# Altium schematic sheet [16]-CLOCK.SchDoc
size A4
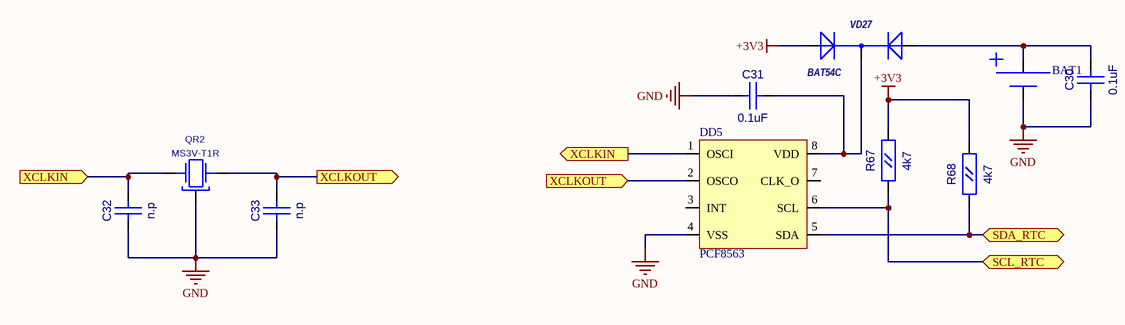
[diagram p0: [16]-CLOCK.SchDoc]

## Parts
BAT1  CR2032-VBY4  [CR2032_ONBOARD]  (value not drawn)
C30  0.1uF  [CC0603]
C31  0.1uF  [CC0603]
C32  n.p  [CC0603]
C33  n.p  [CC0603]
DD5  PCF8563  [SO-8]
QR2  MS3V-T1R  [MS3V-T1R]
R67  4k7  [RC0603]
R68  4k7  [RC0603]
VD27  BAT54C  [SOT-23(123)]

## Ports
SCL_RTC (bidir), SDA_RTC (bidir), XCLKIN (in), XCLKIN (out), XCLKOUT (in), XCLKOUT (out)

## Nets
+3V3: R67.2(B) R68.2(B) VD27.1(A)
GND: BAT1.1 C30.1(A) C31.1(A) C32.1(A) C33.1(A) DD5.4(VSS) QR2.3
SCL_RTC: DD5.6(SCL) R67.1(A) ; port SCL_RTC
SDA_RTC: DD5.5(SDA) R68.1(A) ; port SDA_RTC
XCLKIN: C32.2(B) DD5.1(OSCI) QR2.2(X2) ; port XCLKIN
XCLKOUT: C33.2(B) DD5.2(OSCO) QR2.1(X1) ; port XCLKOUT
NetBAT1_2: BAT1.2 C30.2(B) VD27.2(A)
NetC31_2: C31.2(B) DD5.8(VDD) VD27.3(K)

Not connected (* = marked no-connect by the designer): DD5 3(INT) 7(CLK_O)

## Library data of the parts
BAT1 = CR2032-VBY2: Value: CR2032-VBY4
C30-C33 = CC0603
  C30 C31: Value: 0.1uF
  C32 C33: Value: n.p
QR2 = MS3V-T1R: CRYSTAL_32768 Hz; Value: MS3V-T1R
R67 R68 = RC0603: Value: 4k7
DD5 = PCF8563: Value: PCF8563
VD27 = BAT54C: Value: *